# EAGLE design YogiBear (EAGLE 7.3.0)
AUTHOR: Stanley Liu, Aravind Kumaraguru; REVISION: 9A
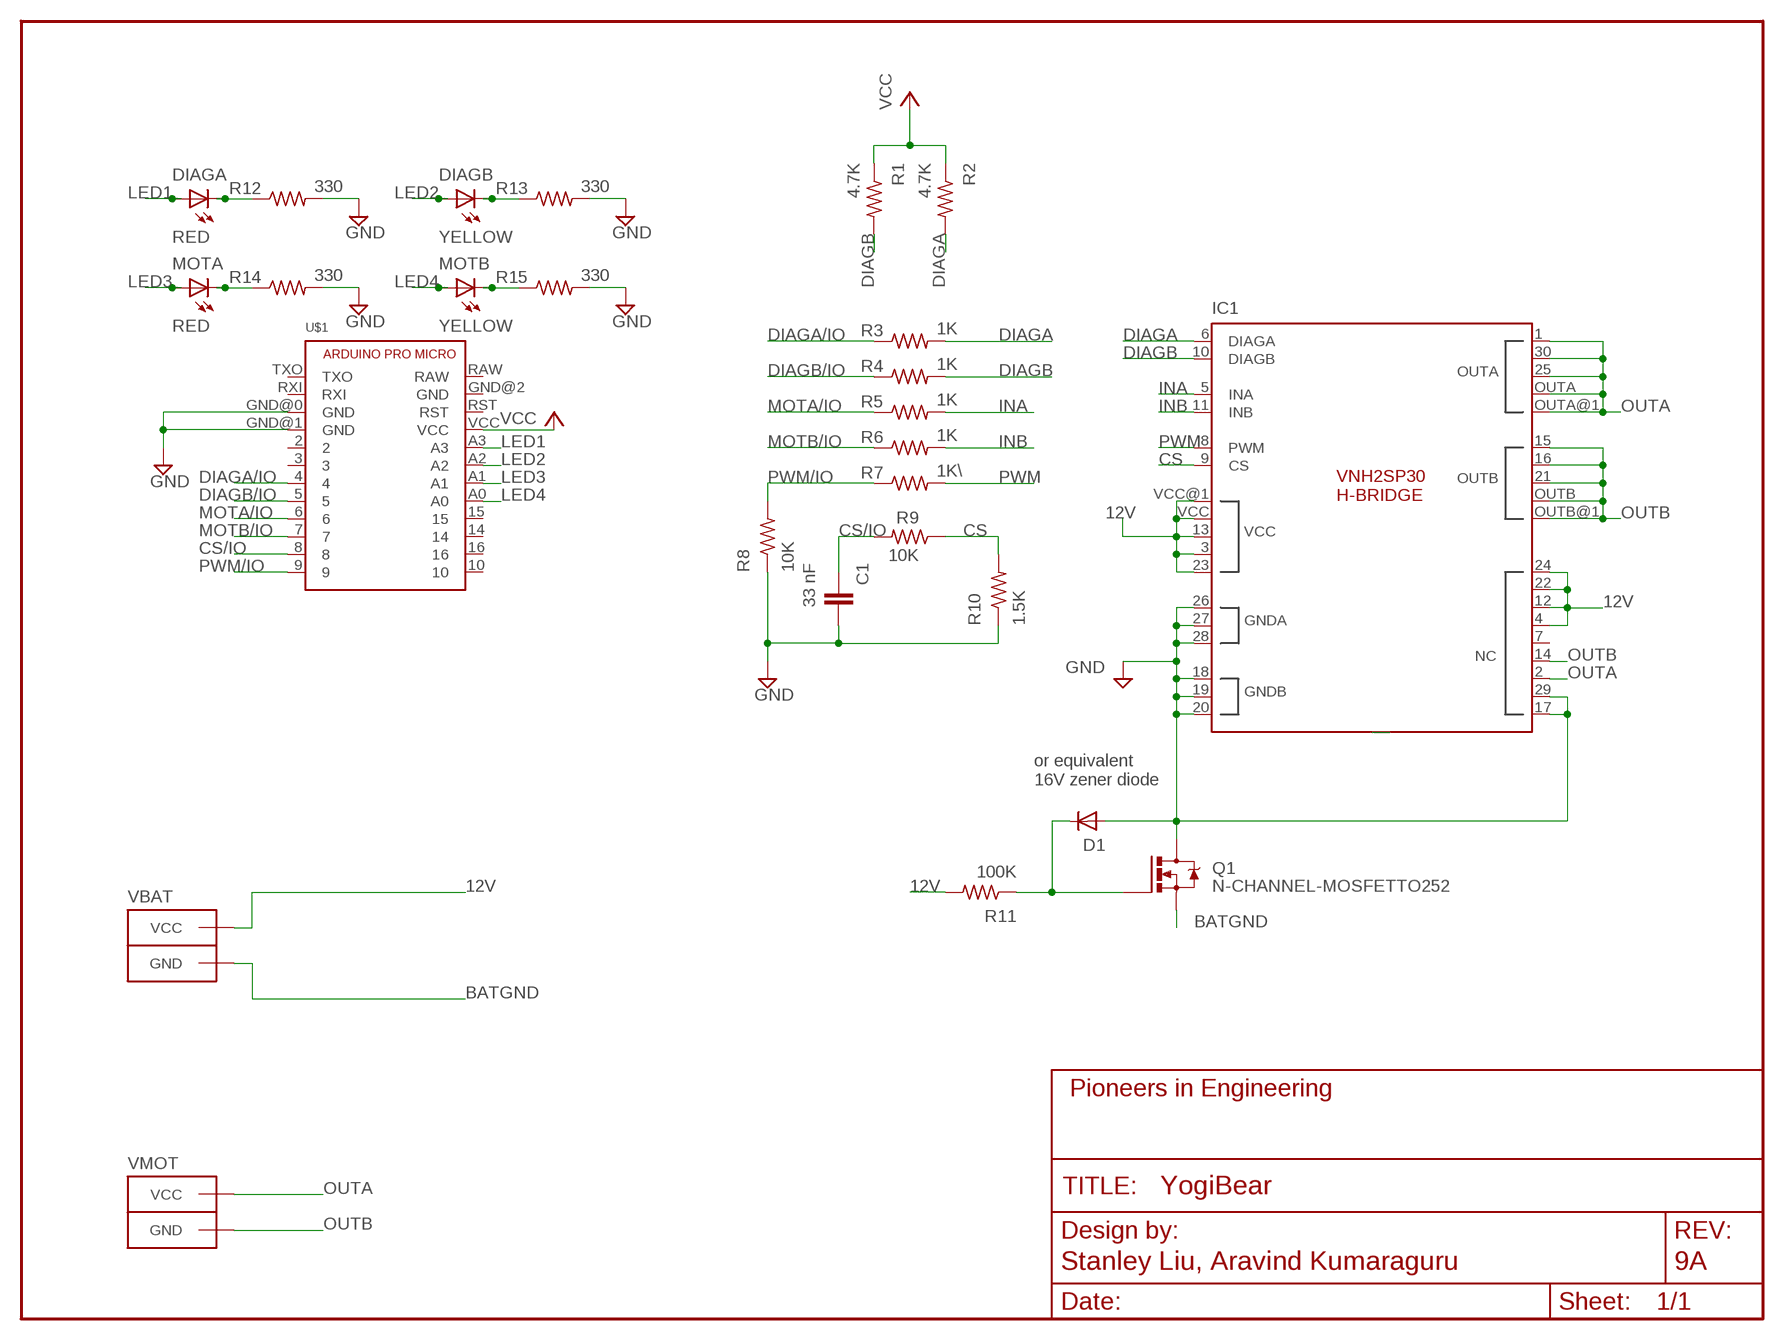
[diagram p0: schematic, sheet 1]

## Parts
C1  33 nF  CAP0603-CAP  [0603-CAP]
D1  DIODESMA-ALT  [SMA-DIODE_ALT]
DIAGA  RED  LED0603  [LED-0603]
DIAGB  YELLOW  LED0603  [LED-0603]
IC1  VNH2SP30  [VNH2SP30]
MOTA  RED  LED0603  [LED-0603]
MOTB  YELLOW  LED0603  [LED-0603]
Q1  N-CHANNEL-MOSFETTO252  [TO252]
R1  4.7K  R-US_R0603  [R0603]
R2  4.7K  R-US_R0603  [R0603]
R3  1K  R-US_R0603  [R0603]
R4  1K  R-US_R0603  [R0603]
R5  1K  R-US_R0603  [R0603]
R6  1K  R-US_R0603  [R0603]
R7  1K\  R-US_R0603  [R0603]
R8  10K  R-US_R0603  [R0603]
R9  10K  R-US_R0603  [R0603]
R10  1.5K  R-US_R0603  [R0603]
R11  100K  R-US_R0603  [R0603]
R12  330  R-US_R0603  [R0603]
R13  330  R-US_R0603  [R0603]
R14  330  R-US_R0603  [R0603]
R15  330  R-US_R0603  [R0603]
U$1  ARDUINO_PRO_MICRO  [ARDUINO_PRO_MICRO]
VBAT  ANDERSONVERTICAL  [ANDERSON_VERTICAL]
VMOT  ANDERSONVERTICAL  [ANDERSON_VERTICAL]

## Nets
12V: IC1.3(VCC) IC1.4(NC5) IC1.12(NC6) IC1.13(VCC) IC1.22(NC7) IC1.23(VCC) IC1.24(NC8) IC1.VCC IC1.VCC@1(VCC) R11.2 VBAT.PIN2(VCC)
BATGND: Q1.2(S) VBAT.PIN1(GND)
CS: IC1.9(CS) R9.1 R10.2
CS/IO: C1.1 R9.2 U$1.8
DIAGA: IC1.6(DIAGA) R2.2 R3.2
DIAGA/IO: R3.1 U$1.4
DIAGB: IC1.10(DIAGB) R1.2 R4.2
DIAGB/IO: R4.1 U$1.5
GND: C1.2 D1.A IC1.17(NC) IC1.18(GNDB) IC1.19(GNDB) IC1.20(GNDB) IC1.26(GNDA) IC1.27(GNDA) IC1.28(GNDA) IC1.29(NC1) Q1.3(D) R8.1 R10.1 R12.2 R13.2 R14.2 R15.2 U$1.GND@0(GND) U$1.GND@1(GND)
INA: IC1.5(INA) R5.2
INB: IC1.11(INB) R6.2
LED1: DIAGA.A U$1.A3
LED2: DIAGB.A U$1.A2
LED3: MOTA.A U$1.A1
LED4: MOTB.A U$1.A0
MOTA/IO: R5.1 U$1.6
MOTB/IO: R6.1 U$1.7
N$2: D1.C Q1.1(G) R11.1
N$7: MOTB.C R15.1
N$8: MOTA.C R14.1
N$9: DIAGB.C R13.1
N$10: DIAGA.C R12.1
OUTA: IC1.1(OUTA) IC1.2(NC2) IC1.25(OUTA) IC1.30(OUTA) IC1.OUTA IC1.OUTA@1(OUTA) VMOT.PIN2(VCC)
OUTB: IC1.14(NC3) IC1.15(OUTB) IC1.16(OUTB) IC1.21(OUTB) IC1.OUTB IC1.OUTB@1(OUTB) VMOT.PIN1(GND)
PWM: IC1.8(PWM) R7.2
PWM/IO: R7.1 R8.2 U$1.9
VCC: R1.1 R2.1 U$1.VCC
Unconnected: U$1.2 U$1.3 U$1.10 U$1.14 U$1.15 U$1.16 U$1.GND@2(GND) U$1.RAW U$1.RST U$1.RXI U$1.TXO

## Notes on the sheet
- or equivalent
  16V zener diode

## Power pins joined to a net without a drawn wire
NC4: IC1.7(NC4)

## Library data of the parts
C1 = pie:CAP: Capacitor Standard 0603 ceramic capacitor, and 0.1" leaded capacitor.; PIE-INT-REF-NUM: CAPACITOR-GENERIC
D1 = pie:DIODE: Diode These are standard reverse protection diodes and small signal diodes. SMA package can handle up to about 1A. SOD-323 can handle about 200mA. What the SOD-323 package when ordering, there are some mfgs out there that are 5-pin packages.; PIE-INT-REF-NUM: DIODE
DIAGA DIAGB MOTA MOTB = pie:LED: LEDs Standard schematic elements and footprints for 5mm, 3mm, 1206, and 0603 sized LEDs. 5mm - Spark Fun Electronics SKU : COM-00529 (and others); PIE-INT-REF-NUM: LED
IC1 = pie:VNH2SP30: FULLY INTEGRATED H-BRIDGE MOTOR DRIVER Source: http://pdf1.alldatasheet.com/datasheet-pdf/view/84563/STMICROELECTRONICS/VNH3SP30.html Modified to match the pinout of VNH2SP30 by adding a CS pin to pin 9.; MPN: VNH3SP30-E; OC_FARNELL: 1739420; OC_NEWARK: 33R1486
Q1 = pie:N-CHANNEL-MOSFET: N-channel TrenchMOS (TM) logic level FET Source: SOT23-3: http://www.nxp.com/documents/data_sheet/BSS123.pdf SOT669: http://www.nxp.com/documents/data_sheet/PH7030L.pdf
R1-R15 = pie:R-US_: RESISTOR, American symbol; PIE-INT-REF-NUM: RESISTOR-GENERIC
U$1 = pie:ARDUINO_PRO_MICRO: Arduino Pro Micro Electrical System Year 9's Smart Sensor Core Pin Outs <https://cdn.sparkfun.com/assets/9/c/3/c/4/523a1765757b7f5c6e8b4567.png> Buy Here <http://www.aliexpress.com/item/Mini-Leonardo-Pro-Micro-ATmega32U4-5V-16MHz-Module-For-Arduino-Best-Quality/32284746884.html?ws_ab_test=searchweb201556_8,searchweb201602_2_10057_10056_10065_10055_10054_10067_10069_10059_10058_10017_10070_10060_10061_10052_10062_10053_10050_10051,searchweb201603_1&btsid=45993952-29ca-4de4-a0fb-c7fb72b8e1a5>
VBAT VMOT = pie:ANDERSON: 2-pin 25A Anderson Connector http://www.alliedelec.com/images/products/datasheets/bm/ANDERSON_POWER_PRODUCTS/70162018.pdf; PIE-INT-REF-NUM: Anderson

## Board
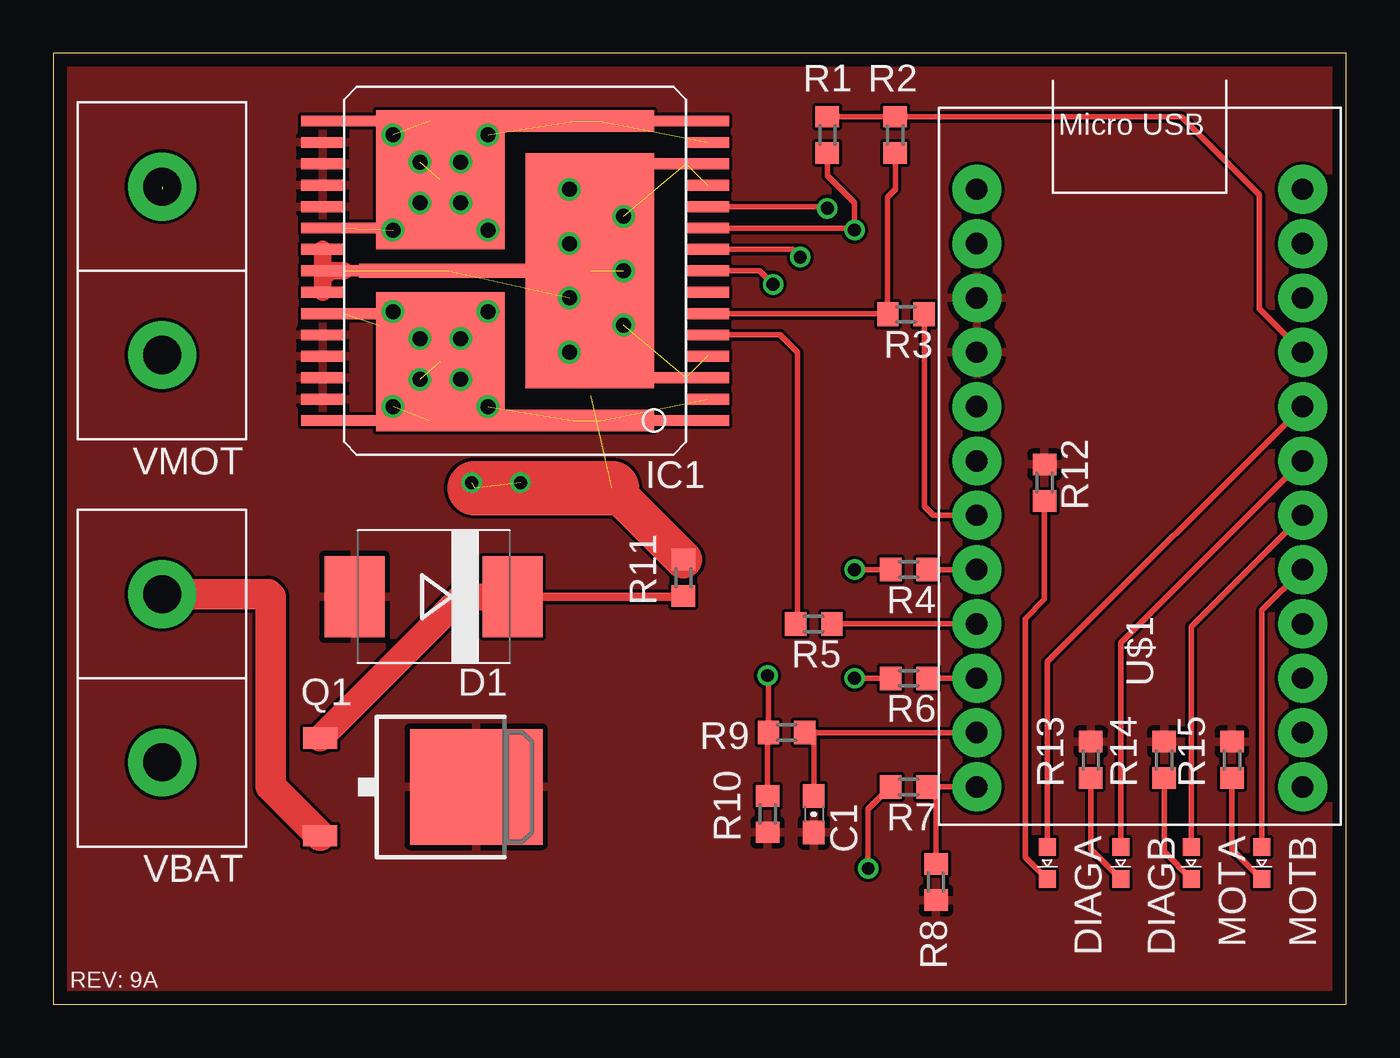
[diagram p1: board, top side]
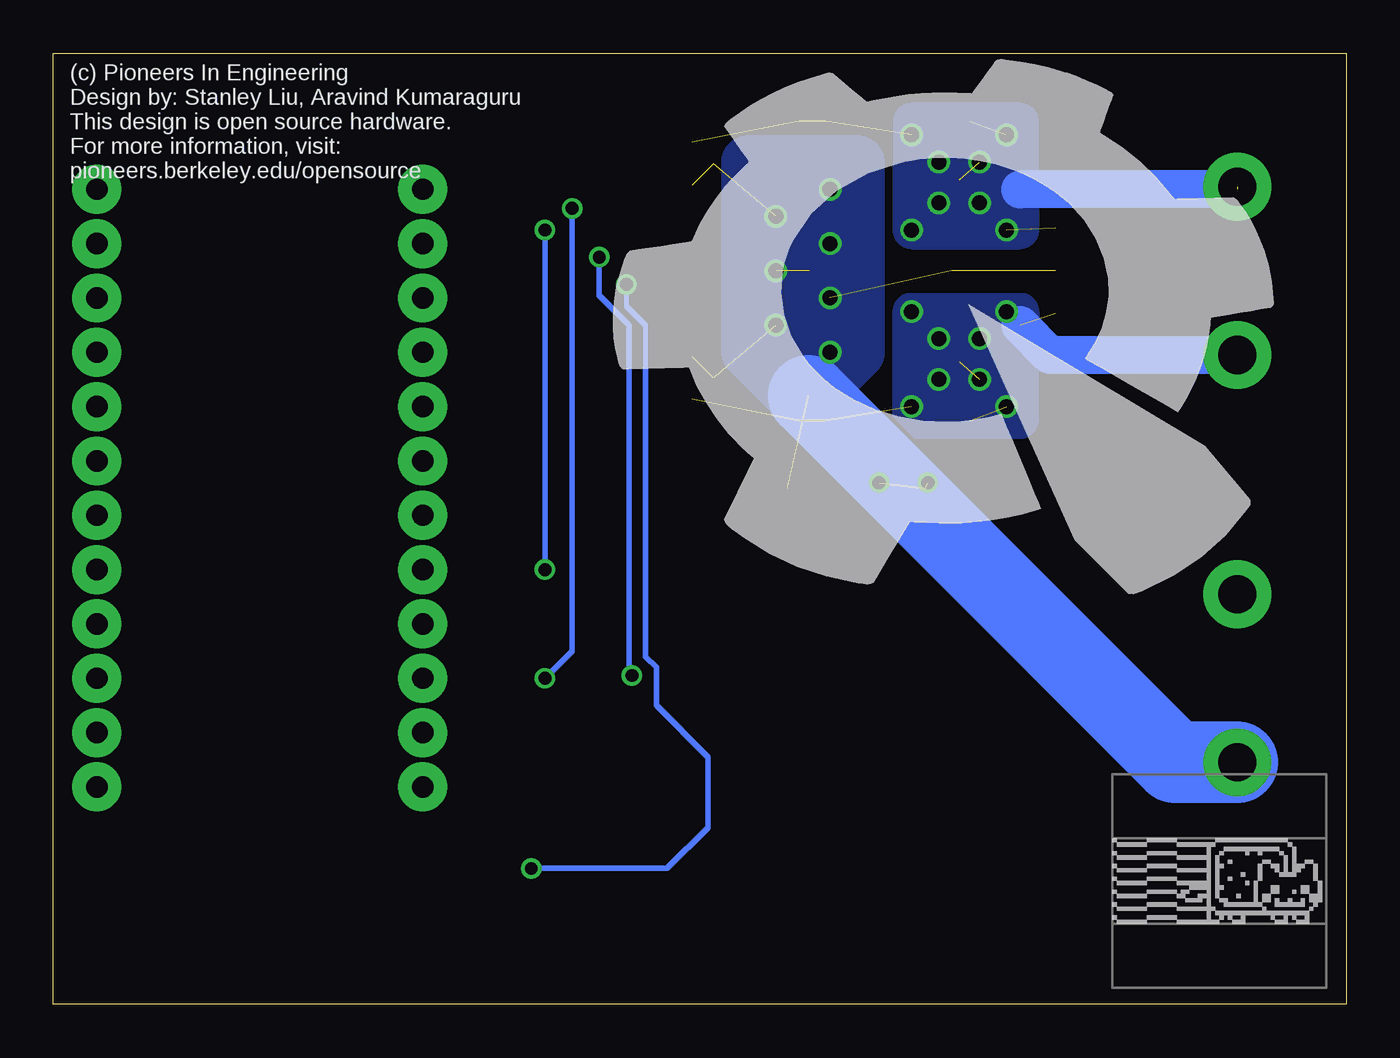
[diagram p2: board, bottom side, seen from below]

Size 60.45 x 44.45 mm. Coordinates in mm from the lower left corner, seen from the top.
Outline: 60.45,0 60.45,44.45 0,44.45 0,0 60.45,0
Copper layers (1*16): Top 2mil / dielectric 9mil / Bottom 2mil
Design rules "pie": minimum track width 6mil, minimum drill 15mil, track to track 6mil, track to pad 6mil, pad to pad 6mil, via to via 6mil, smd to smd 6mil, copper to edge 25mil, drill to drill 7mil, minimum pad ring 7mil, minimum via ring 7mil, stop-mask expansion 3mil, vias tented up to drill 21mil, thermal gap 10mil

### Footprints (pad centres in the part's own frame; a part is rotated, then mirrored left to right if it is on the bottom)
0603-CAP = smd 1.1 x 1: 1 -0.85,0; 2 0.85,0
SMC = smd 2.8 x 3.8: A 3.7,0; C -3.7,0
LED-0603 = smd 0.8 x 0.8: A 0,-0.75; C 0,0.75
VNH2SP30 = smd 0.508 x 12: 1 -7,-4; 15 7,-4; 16 7,4; 30 -7,4 | smd 0.508 x 2: 2 -6,-9; 4 -4,-9; 5 -3,-9; 6 -2,-9; 7 -1,-9; 8 0,-9; 9 1,-9; 10 2,-9; 11 3,-9; 12 4,-9; 14 6,-9; 17 6,9; 18 5,9; 19 4,9; 20 3,9; 22 1,9; 24 -1,9; 26 -3,9; 27 -4,9; 28 -5,9; 29 -6,9; 31 -7,9 | smd 0.508 x 4: 3 -5,-8; 13 5,-8; 21 2,8; 23 0,8; 25 -2,8 | smd 6.5 x 6: OUTA -4.25,3.5; OUTB 4.25,3.5 | smd 1 x 7.5: OUTA@1 -7,-2.755; OUTB@1 7,-2.755 | smd 11 x 6: VCC 0,-3.5 | smd 0.65 x 8.3: VCC@1 0,3.145
TO252 = smd 1 x 1.6: 1 -2.28,-4.8; 2 2.28,-4.8 | smd 5.4 x 6.2: 3 0,2.5
R0603 = smd 1 x 1.1: 1 -0.85,0; 2 0.85,0
ARDUINO_PRO_MICRO = drill 1 pad 2.286: 2 1.27,19.05; 3 1.27,16.51; 4 1.27,13.97; 5 1.27,11.43; 6 1.27,8.89; 7 1.27,6.35; 8 1.27,3.81; 9 1.27,1.27; 10 16.51,1.27; 14 16.51,6.35; 15 16.51,8.89; 16 16.51,3.81; A0 16.51,11.43; A1 16.51,13.97; A2 16.51,16.51; A3 16.51,19.05; GND@0 1.27,24.13; GND@1 1.27,21.59; GND@2 16.51,26.67; RAW 16.51,29.21; RST 16.51,24.13; RXI 1.27,26.67; TXO 1.27,29.21; VCC 16.51,21.59
ANDERSON_VERTICAL = drill 1.778 pad 3.175: PIN1 0,-3.937; PIN2 0,3.937

### Placement (x,y rotation side)
C1  35.56,8.89 270 top
D1  [SMC]  17.78,19.05 180 top
DIAGA  46.48,6.6 180 top
DIAGB  49.91,6.6 180 top
IC1  21.59,34.29 90 top
MOTA  53.21,6.6 180 top
MOTB  56.52,6.6 180 top
Q1  17.27,10.16 270 top
R1  36.2,40.64 270 top
R2  39.37,40.64 270 top
R3  39.88,32.26 180 top
R4  40.01,20.32 180 top
R5  35.56,17.78 180 top
R6  40.01,15.24 180 top
R7  40.01,10.16 180 top
R8  41.27,5.71 90 top
R9  34.29,12.7 0 top
R10  33.4,8.89 90 top
R11  29.46,19.94 90 top
R12  46.35,24.38 90 top
R13  48.51,11.43 90 top
R14  51.94,11.43 90 top
R15  55.12,11.43 90 top
U$1  41.91,8.89 0 top
U$2  [PIE-LOGO]  17.78,32.51 0 bottom
U$3  [NYAN-1CM]  10.92,0.76 0 bottom
VBAT  5.08,15.24 180 top
VMOT  5.08,34.29 180 top

### Tracks (layer width: path | path; a pad name or v marks a point on that pad's centre or on a via)
12V  (via drill 0.6, 0.7)  (10 unrouted)
  Top 0.813: IC1.24 IC1.22 12.59,34.15 12.7,34.04 12.95,34.29 IC1.23
  Top 1.778: R11.2 26.12,24.13
  Top 2.54: 26.12,24.13 19.68,24.13
  Bottom 3.81: VBAT.PIN2 8,11.3 25.15,28.45
  other vias: 24.13,38.1 26.67,36.83 24.13,35.56 26.67,34.29 24.13,33.02 26.67,31.75 24.13,30.48 21.84,24.38 19.56,24.38
  pour Bottom: 25.4,27.94 27.94,30.48 27.94,39.37 22.86,39.37 22.86,30.48
BATGND
  Top 1.422: VBAT.PIN1 10.03,19.18 10.16,19.05 10.16,10.19 Q1.2
CS  (via drill 0.6)
  Top 0.254: v33.4,15.37 33.44,15.33 R9.1 33.4,12.66 R10.2 | IC1.9 34.56,35.29 v34.92,34.92
  Bottom 0.254: v34.92,34.92 34.92,33.15 33.53,31.75 33.53,15.49 v33.4,15.37
CS/IO
  Top 0.254: U$1.8 35.56,12.7 C1.1
  Top 0.406: R9.2 35.56,12.7
DIAGA
  Top 0.254: IC1.6 39,32.29 | 39,32.29 R3.2 | 39,32.29 39,37.73 39.37,38.1 R2.2
DIAGA/IO
  Top 0.254: R3.1 40.73,23.28 41.15,22.86 U$1.4
DIAGB  (via drill 0.6)
  Top 0.254: v37.47,20.32 R4.2 | IC1.10 37.37,36.29 v37.47,36.2 37.47,37.47 36.2,38.73 R1.2
  Bottom 0.254: v37.47,20.32 v37.47,36.2
DIAGB/IO
  Top 0.254: U$1.5 R4.1
GND
  pour Top: 0,0 60.45,0 60.45,44.45 0,44.45
INA
  Top 0.254: IC1.5 33.99,31.29 34.8,30.48 34.8,17.87 R5.2
INB  (via drill 0.6)
  Top 0.254: R6.2 v37.47,15.24 | IC1.11 36.12,37.29 v36.2,37.21
  Bottom 0.254: v36.2,37.21 36.2,16.51 v37.47,15.24
LED1
  Top 0.254: DIAGA.A 46.48,16 U$1.A3
LED2
  Top 0.254: DIAGB.A 49.91,16.89 U$1.A2
LED3
  Top 0.254: MOTA.A 53.21,17.65 U$1.A1
LED4
  Top 0.254: MOTB.A 56.52,18.41 U$1.A0
MOTA/IO
  Top 0.254: R5.1 U$1.6
MOTB/IO
  Top 0.254: R6.1 U$1.7
N$2
  Top 0.406: D1.C 29.43,19.05 R11.1
  Top 1.27: Q1.1 19.08,19.05 D1.C
N$7
  Top 0.254: R15.1 55.12,7.25 MOTB.C
N$8
  Top 0.254: R14.1 51.94,7.12 MOTA.C
N$9
  Top 0.254: R13.1 48.51,7.25 DIAGB.C
N$10
  Top 0.254: R12.1 46.35,18.92 45.47,18.03 45.47,6.87 DIAGA.C
OUTA  (via drill 0.7)  (6 unrouted)
  Bottom 1.778: VMOT.PIN2 13.84,30.35 15.24,31.75
  other vias: 15.88,32.38 17.14,31.11 19.05,31.11 19.05,29.21 20.32,32.38 20.32,27.94 17.14,29.21 15.88,27.94
  pour Bottom: 15.24,32.38 15.24,27.3 20.32,27.3 20.32,32.38
OUTB  (via drill 0.7)  (7 unrouted)
  Bottom 1.778: 5.08,38.1 15.24,38.1
  other vias: 15.88,40.64 17.14,39.37 19.05,39.37 20.32,40.64 19.05,37.47 17.14,37.47 15.88,36.2 20.32,36.2
  pour Bottom: 15.24,36.2 15.24,41.27 20.32,41.27 20.32,36.2
PWM  (via drill 0.6)
  Top 0.254: v38.1,6.35 38.1,9.11 R7.2 | IC1.8 33.02,34.29 v33.66,33.66
  Bottom 0.254: v38.1,6.35 31.75,6.35 29.84,8.26 29.84,11.56 32.26,13.97 32.26,15.75 32.77,16.26 32.77,31.75 33.66,32.64 v33.66,33.66
PWM/IO
  Top 0.254: U$1.9 R7.1 41.27,9.74 R8.2
VCC
  Top 0.254: R1.1 R2.1 52.74,41.49 56.39,37.85 56.39,32.51 U$1.VCC

### Text on the board
tPlace: REV: 9A
bPlace: (c) Pioneers In Engineering / Design by: Stanley Liu, Aravind Kumaraguru / This design is open source hardware. / For more information, visit: / pioneers.berkeley.edu/opensource